# Altium schematic sheet InterfaceConfiguracao.SchDoc: CONTROLADORA AIRPOPCORN
size A3; DocumentNumber: 5; SheetNumber: 5; SheetTotal: 15
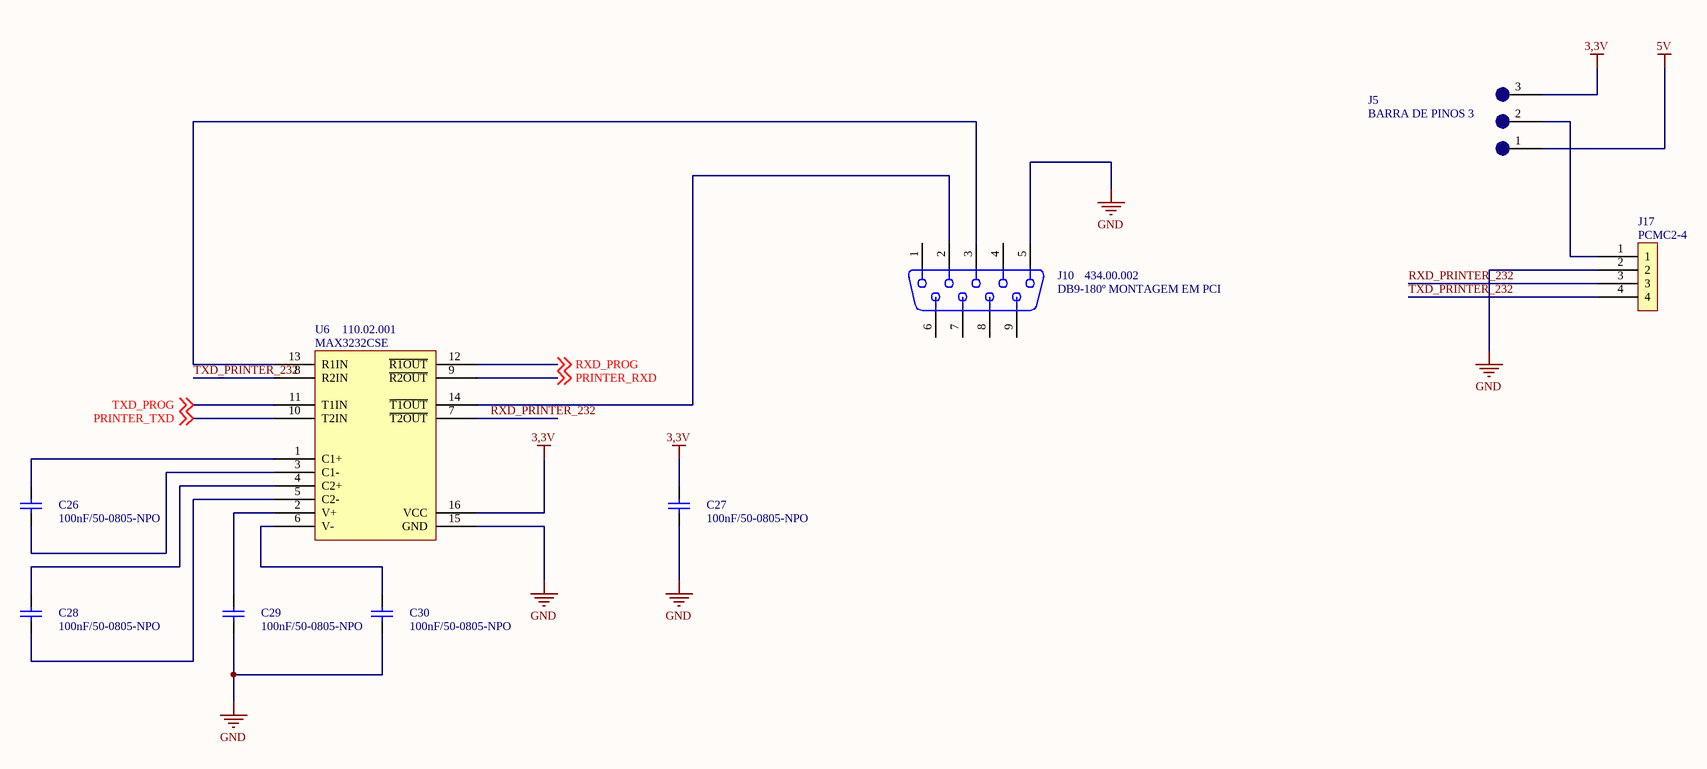
[diagram p0: InterfaceConfiguracao.SchDoc]

## Parts
C26  100nF/50-0805-NPO  [0805-REVISADO ONDA]
C27  100nF/50-0805-NPO  [0805-REVISADO ONDA]
C28  100nF/50-0805-NPO  [0805-REVISADO ONDA]
C29  100nF/50-0805-NPO  [0805-REVISADO ONDA]
C30  100nF/50-0805-NPO  [0805-REVISADO ONDA]
J5  BARRA DE PINOS 3  [JUMPO 3 VIAS]
J10  DB9-180º MONTAGEM EM PCI  ERP: 434.00.002  [DB9-FÊMEA MONTAGEM EM PCI 180]
J17  PCMC2-4  [PCMC2-4]
U6  MAX3232CSE  ERP: 110.02.001  [SOIC 16 PINOS]

## Nets
3,3V: C27.2 J5.3 U6.16(VCC)
5V: J5.1
GND: C27.1 C29.1 C30.1 J10.5 J17.2 U6.15(GND)
PRINTER_RXD: U6.9(~{R2OUT}) ; off-sheet PRINTER_RXD
PRINTER_TXD: U6.10(T2IN) ; off-sheet PRINTER_TXD
RXD_PRINTER_232: J17.3 U6.7(~{T2OUT})
RXD_PROG: U6.12(~{R1OUT}) ; off-sheet RXD_PROG
TXD_PRINTER_232: J17.4 U6.8(R2IN)
TXD_PROG: U6.11(T1IN) ; off-sheet TXD_PROG
NetC26_1: C26.1 U6.3(C1-)
NetC26_2: C26.2 U6.1(C1+)
NetC28_1: C28.1 U6.5(C2-)
NetC28_2: C28.2 U6.4(C2+)
NetC29_2: C29.2 U6.2(V+)
NetC30_2: C30.2 U6.6(V-)
NetJ5_2: J5.2 J17.1
NetJ10_2: J10.2 U6.14(~{T1OUT})
NetJ10_3: J10.3 U6.13(R1IN)

Not connected (* = marked no-connect by the designer): J10 1 4 6 7 8 9

## Notes on the sheet
- NOME
- DATA
- PROJETO
- DESCRIÇÃO
- desenho
- verif.
- aprov.
- TAMANHO
- CODIGO
- Todas as informações disponíveis
- não devem ser divulgadas,
- em parte ou todo.
- CIRCUITO IMPRESSO
- MONTAGEM ELETRÔNICA
- A4
- de

## Library data of the parts
J5 = JUMPER 3
J10 = DB-9 - FÊMEA 180º MONTAGEM EM PCI: DBPCF-09
C26-C30 = 100nF/50-0805-NPO: ERP: 104.11.005